# Altium schematic sheet RP2040.SchDoc
size A4; SheetNumber: 2; SheetTotal: 11
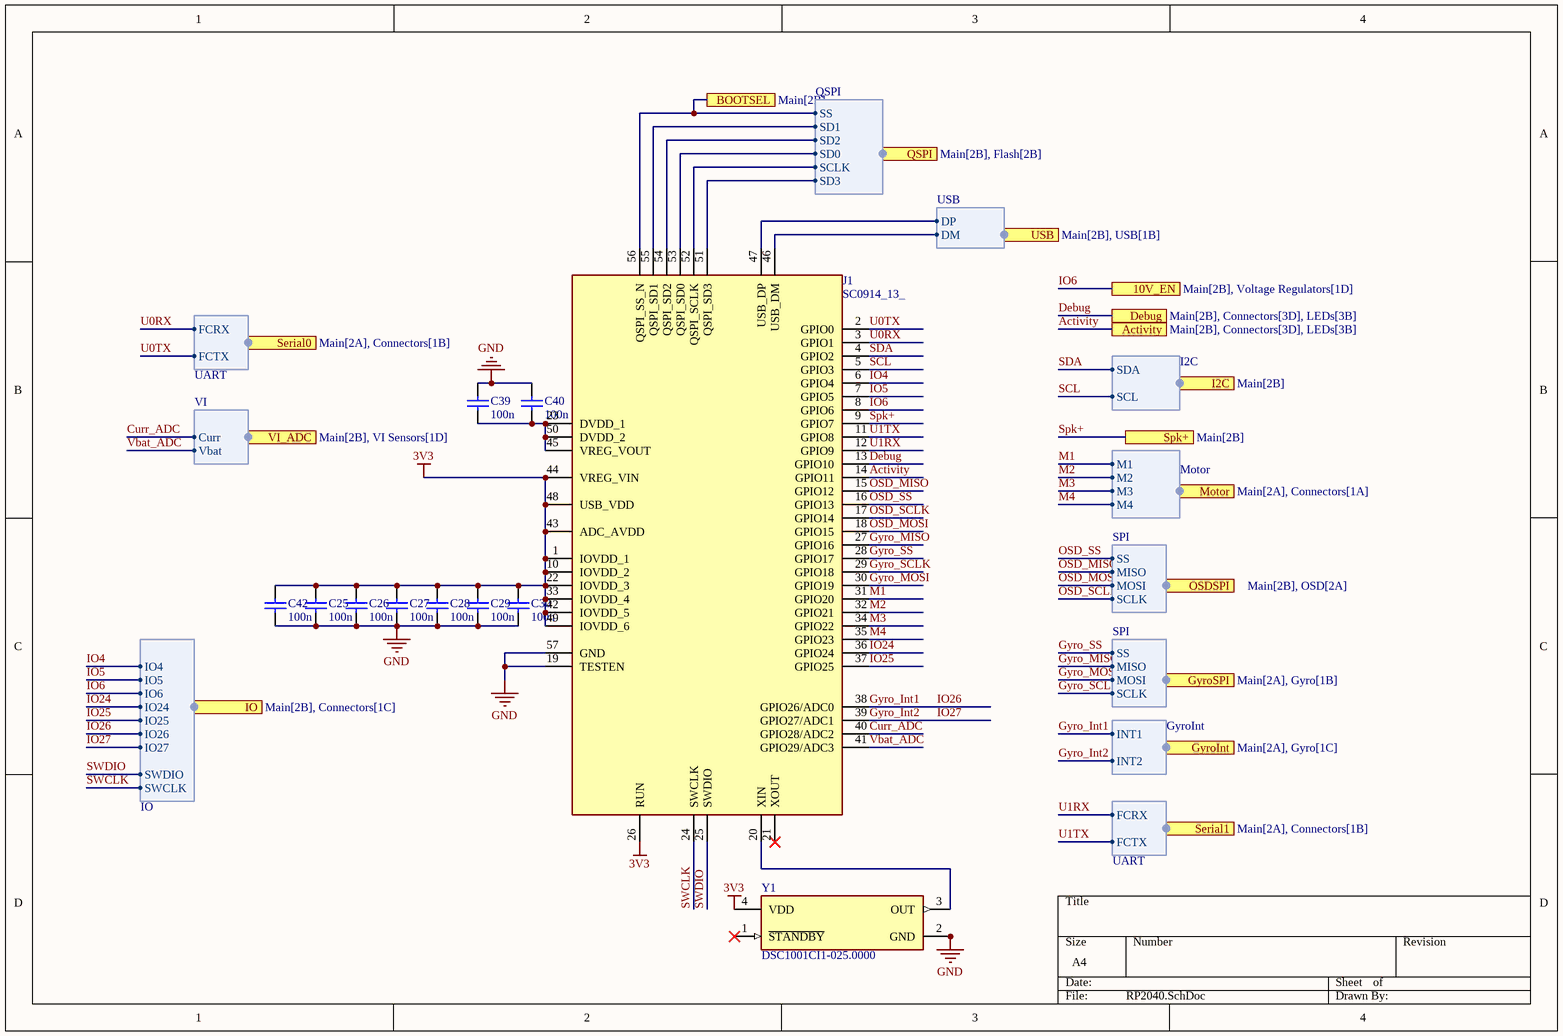
[diagram p0: RP2040.SchDoc]

## Parts
C25  100n  [CAPC0603(1608)55_N]
C26  100n  [CAPC0603(1608)55_N]
C27  100n  [CAPC0603(1608)55_N]
C28  100n  [CAPC0603(1608)55_N]
C29  100n  [CAPC0603(1608)55_N]
C30  100n  [CAPC0603(1608)55_N]
C39  100n  [CAPC0603(1608)55_N]
C40  100n  [CAPC0603(1608)55_N]
C42  100n  [CAPC0603(1608)55_N]
J1  SC0914_13_  [SC091413]
Y1  DSC1001CI1-025.0000  [FP-CDFN3225-4LD-PL-1-MFG]

## Ports
10V_EN (see Main[2B], Voltage Regulators[1D]), Activity (see Main[2B], Connectors[3D], LEDs[3B]), BOOTSEL (see Main[2B]), Debug (see Main[2B], Connectors[3D], LEDs[3B]), GyroInt (harness GyroInt, see Main[2A], Gyro[1C]), GyroSPI (harness SPI, see Main[2A], Gyro[1B]), I2C (harness I2C, see Main[2B]), IO (harness IO, see Main[2B], Connectors[1C]), Motor (harness Motor, see Main[2A], Connectors[1A]), OSDSPI (harness SPI, see Main[2B], OSD[2A]), QSPI (harness QSPI, see Main[2B], Flash[2B]), Serial0 (harness UART, see Main[2A], Connectors[1B]), Serial1 (harness UART, see Main[2A], Connectors[1B]), Spk+ (see Main[2B]), USB (harness USB, see Main[2B], USB[1B]), VI_ADC (harness VI, see Main[2B], VI Sensors[1D])

## Harnesses
QSPI: SS, SD1, SD2, SD0, SCLK, SD3
USB: DP, DM
I2C: SDA, SCL
SPI: SS, MISO, MOSI, SCLK
GyroInt: INT1, INT2
UART: FCRX, FCTX
Motor: M2, M4, M1, M3
VI: Curr, Vbat
IO: IO4, IO5, IO6, IO24, IO25, IO26, IO27, SWDIO, SWCLK

## Nets
3V3: C25.2 C26.2 C27.2 C28.2 C29.2 C30.2 C42.2 J1.1(IOVDD_1) J1.10(IOVDD_2) J1.22(IOVDD_3) J1.26(RUN) J1.33(IOVDD_4) J1.42(IOVDD_5) J1.43(ADC_AVDD) J1.44(VREG_VIN) J1.48(USB_VDD) J1.49(IOVDD_6) Y1.4(VDD)
GND: C25.1 C26.1 C27.1 C28.1 C29.1 C30.1 C39.2 C40.2 C42.1 J1.19(TESTEN) J1.57(GND) Y1.2(GND)
Activity: J1.14(GPIO11) ; port Activity
BOOTSEL: J1.56(QSPI_SS_N) ; port BOOTSEL, port QSPI.SS
Curr_ADC: J1.40(GPIO28/ADC2) ; port VI_ADC.Curr
Debug: J1.13(GPIO10) ; port Debug
Gyro_Int1: J1.38(GPIO26/ADC0) ; port GyroInt.INT1, port IO.IO26  [also labelled IO26]
Gyro_Int2: J1.39(GPIO27/ADC1) ; port GyroInt.INT2, port IO.IO27  [also labelled IO27]
Gyro_MISO: J1.27(GPIO16) ; port GyroSPI.MISO
Gyro_MOSI: J1.30(GPIO19) ; port GyroSPI.MOSI
Gyro_SCLK: J1.29(GPIO18) ; port GyroSPI.SCLK
Gyro_SS: J1.28(GPIO17) ; port GyroSPI.SS
IO4: J1.6(GPIO4) ; port IO.IO4
IO5: J1.7(GPIO5) ; port IO.IO5
IO6: J1.8(GPIO6) ; port 10V_EN, port IO.IO6
IO24: J1.36(GPIO24) ; port IO.IO24
IO25: J1.37(GPIO25) ; port IO.IO25
M1: J1.31(GPIO20) ; port Motor.M1
M2: J1.32(GPIO21) ; port Motor.M2
M3: J1.34(GPIO22) ; port Motor.M3
M4: J1.35(GPIO23) ; port Motor.M4
OSD_MISO: J1.15(GPIO12) ; port OSDSPI.MISO
OSD_MOSI: J1.18(GPIO15) ; port OSDSPI.MOSI
OSD_SCLK: J1.17(GPIO14) ; port OSDSPI.SCLK
OSD_SS: J1.16(GPIO13) ; port OSDSPI.SS
SCL: J1.5(GPIO3) ; port I2C.SCL
SDA: J1.4(GPIO2) ; port I2C.SDA
Spk+: J1.9(GPIO7) ; port Spk+
SWCLK: J1.24(SWCLK) ; port IO.SWCLK
SWDIO: J1.25(SWDIO) ; port IO.SWDIO
U0RX: J1.3(GPIO1) ; port Serial0.FCRX
U0TX: J1.2(GPIO0) ; port Serial0.FCTX
U1RX: J1.12(GPIO9) ; port Serial1.FCRX
U1TX: J1.11(GPIO8) ; port Serial1.FCTX
Vbat_ADC: J1.41(GPIO29/ADC3) ; port VI_ADC.Vbat
NetC39_1: C39.1 C40.1 J1.23(DVDD_1) J1.45(VREG_VOUT) J1.50(DVDD_2)
NetJ1_20: J1.20(XIN) Y1.3(OUT)
NetJ1_46: J1.46(USB_DM) ; port USB.DM
NetJ1_47: J1.47(USB_DP) ; port USB.DP
NetJ1_51: J1.51(QSPI_SD3) ; port QSPI.SD3
NetJ1_52: J1.52(QSPI_SCLK) ; port QSPI.SCLK
NetJ1_53: J1.53(QSPI_SD0) ; port QSPI.SD0
NetJ1_54: J1.54(QSPI_SD2) ; port QSPI.SD2
NetJ1_55: J1.55(QSPI_SD1) ; port QSPI.SD1

Not connected (* = marked no-connect by the designer): J1 21(XOUT)*; Y1 1(~{STANDBY})*

## Library data of the parts
C25-C30 C39 C40 C42 = Cap 100n: Keramikvielschichtkondensator, SMD, Baureihe MC, ± 20%; Manufacturer: Multicomp; OC_FARNELL: 1759038; Value: 100n; PackageReference: 0603
J1 = SC0914_13_: Connector; Manufacturer_Name: RASPBERRY-PI; Manufacturer_Part_Number: SC0914(13); Datasheet Link: https://datasheets.raspberrypi.com/rp2040/rp2040-datasheet.pdf; Height: 0.9mm; Mouser Part Number: 358-SC091413; Mouser Price/Stock: https://www.mouser.co.uk/ProductDetail/Raspberry-Pi/SC091413?qs=T%252BzbugeAwjhr%252BUbBr3TJcw%3D%3D
Y1 = CMP-06255-000034-1: MEMS OSC XO 25.0000MHZ CMOS SMD; Load Capacitance: 15pF; Max Supply Voltage: 3.6V; Min Supply Voltage: 2.7V; Max Supply Current: 6.3mA; Frequency Stability: 50ppm; Frequency: 25MHz; Max Duty Cycle: 55%; Number of Pins: 4; Height: 0.035inch; Packaging: Rail/Tube; Max Operating Temperature: 85°C; Length: 0.126inch; Case/Package: SMD/SMT; Series: DSC1001; Width: 0.098inch; Termination: SMD/SMT; Package Quantity: 110; Mount: Surface Mount; Ratings: AEC-Q100; Min Operating Temperature: -40°C